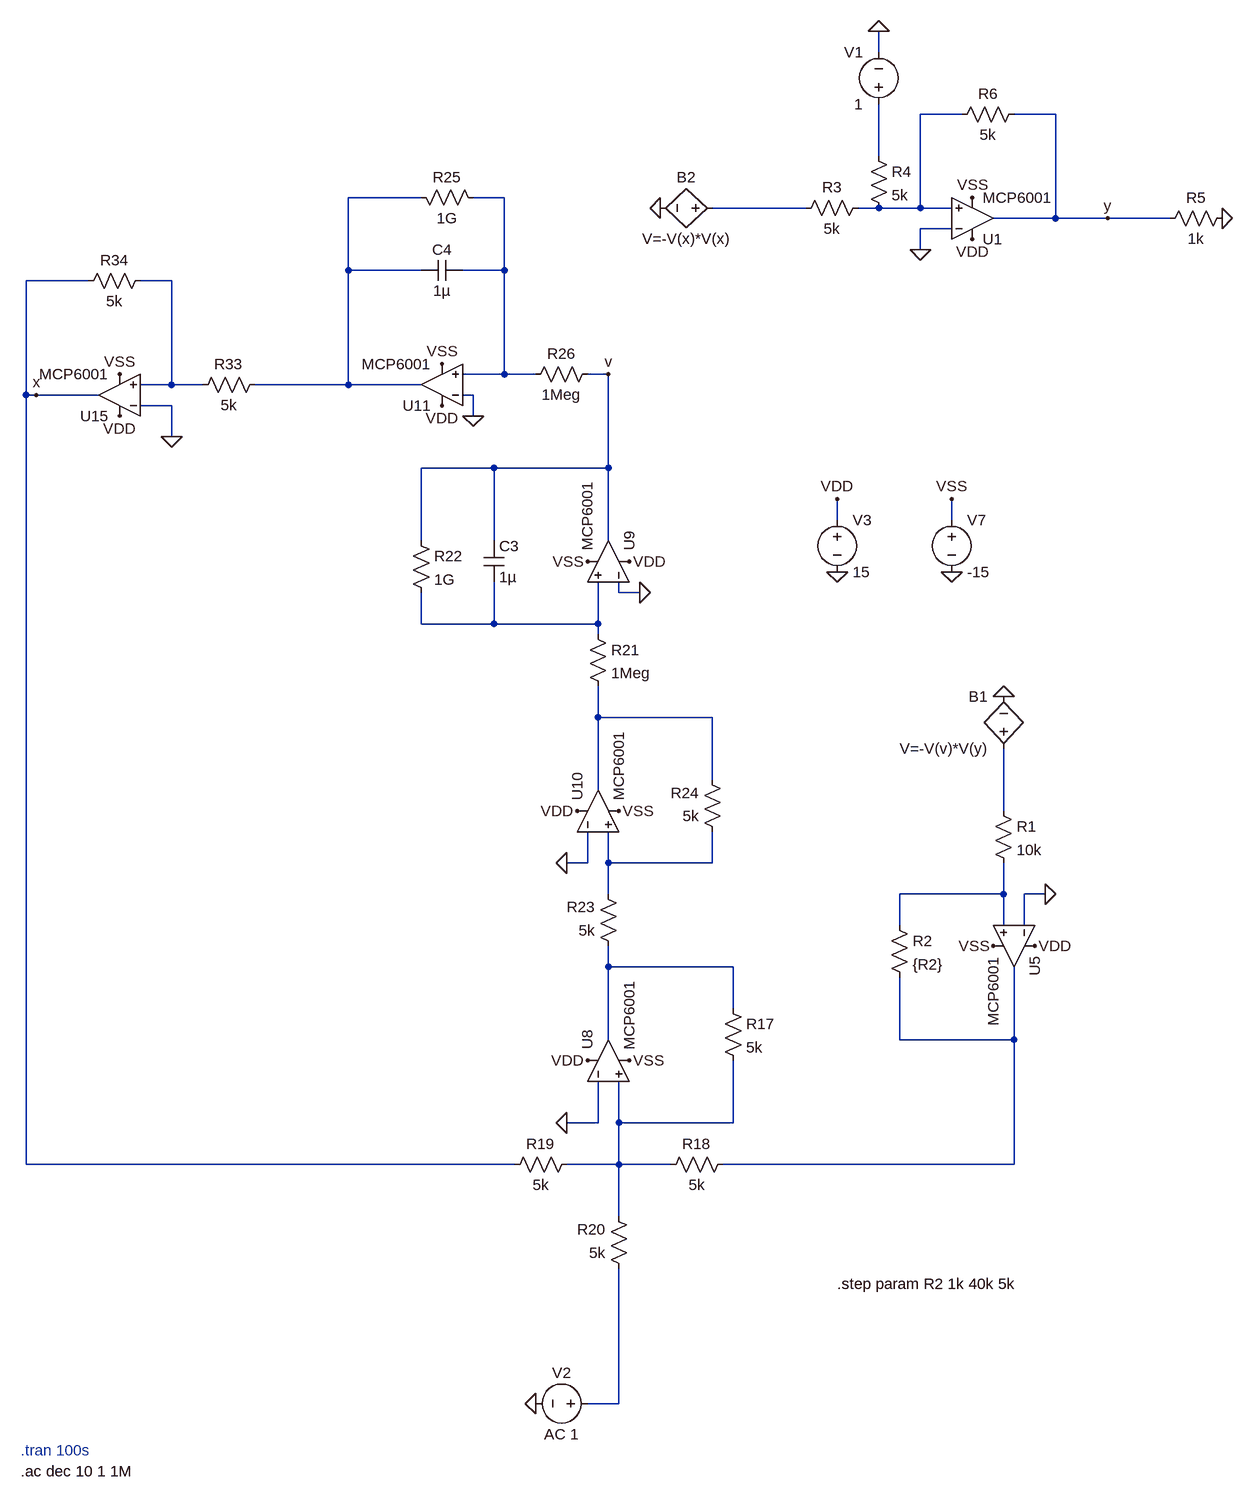
[diagram p0: schematic vanderpol.asc]
vanderpol.asc, the LTspice schematic file:
Version 4
SHEET 1 4244 1992
WIRE 3696 -208 3696 -240
WIRE 3824 -112 3760 -112
WIRE 3968 -112 3904 -112
WIRE 3696 -48 3696 -128
WIRE 2992 16 2880 16
WIRE 3120 16 3072 16
WIRE 3584 32 3440 32
WIRE 3696 32 3664 32
WIRE 3760 32 3760 -112
WIRE 3760 32 3696 32
WIRE 3808 32 3760 32
WIRE 3968 48 3968 -112
WIRE 3968 48 3872 48
WIRE 4048 48 3968 48
WIRE 4144 48 4048 48
WIRE 3808 64 3760 64
WIRE 3760 96 3760 64
WIRE 2880 128 2880 16
WIRE 2992 128 2880 128
WIRE 3120 128 3120 16
WIRE 3120 128 3056 128
WIRE 2480 144 2384 144
WIRE 2608 144 2560 144
WIRE 3120 288 3120 128
WIRE 3120 288 3056 288
WIRE 3168 288 3120 288
WIRE 3280 288 3248 288
WIRE 2608 304 2608 144
WIRE 2608 304 2560 304
WIRE 2656 304 2608 304
WIRE 2880 304 2880 128
WIRE 2880 304 2736 304
WIRE 2992 304 2880 304
WIRE 2384 320 2384 144
WIRE 2400 320 2384 320
WIRE 2496 320 2400 320
WIRE 3072 320 3056 320
WIRE 2608 336 2560 336
WIRE 3072 352 3072 320
WIRE 2608 384 2608 336
WIRE 3104 432 2992 432
WIRE 3280 432 3280 288
WIRE 3280 432 3104 432
WIRE 3632 512 3632 480
WIRE 3808 512 3808 480
WIRE 2992 544 2992 432
WIRE 3104 544 3104 432
WIRE 3280 544 3280 432
WIRE 3296 624 3296 608
WIRE 3328 624 3296 624
WIRE 2992 672 2992 624
WIRE 3104 672 3104 608
WIRE 3104 672 2992 672
WIRE 3264 672 3264 608
WIRE 3264 672 3104 672
WIRE 3264 688 3264 672
WIRE 3264 816 3264 768
WIRE 3440 816 3264 816
WIRE 3440 912 3440 816
WIRE 3264 928 3264 816
WIRE 3888 960 3888 864
WIRE 3248 1040 3248 992
WIRE 3248 1040 3216 1040
WIRE 3280 1040 3280 992
WIRE 3440 1040 3440 992
WIRE 3440 1040 3280 1040
WIRE 3280 1088 3280 1040
WIRE 3888 1088 3888 1040
WIRE 3888 1088 3728 1088
WIRE 3952 1088 3920 1088
WIRE 3728 1136 3728 1088
WIRE 3888 1136 3888 1088
WIRE 3920 1136 3920 1088
WIRE 3280 1200 3280 1168
WIRE 3472 1200 3280 1200
WIRE 3472 1264 3472 1200
WIRE 3280 1312 3280 1200
WIRE 3728 1312 3728 1216
WIRE 3904 1312 3904 1200
WIRE 3904 1312 3728 1312
WIRE 3264 1440 3264 1376
WIRE 3264 1440 3216 1440
WIRE 3296 1440 3296 1376
WIRE 3472 1440 3472 1344
WIRE 3472 1440 3296 1440
WIRE 2384 1504 2384 320
WIRE 3136 1504 2384 1504
WIRE 3296 1504 3296 1440
WIRE 3296 1504 3216 1504
WIRE 3376 1504 3296 1504
WIRE 3904 1504 3904 1312
WIRE 3904 1504 3456 1504
WIRE 3296 1584 3296 1504
WIRE 3296 1872 3296 1664
WIRE 3296 1872 3248 1872
FLAG 3888 784 0
FLAG 3952 1088 0
FLAG 3872 1168 VSS
FLAG 3936 1168 VDD
FLAG 3168 1872 0
FLAG 3216 1440 0
FLAG 3312 1344 VSS
FLAG 3248 1344 VDD
FLAG 3632 592 0
FLAG 3632 480 VDD
FLAG 3808 592 0
FLAG 3808 480 VSS
FLAG 3216 1040 0
FLAG 3296 960 VSS
FLAG 3232 960 VDD
FLAG 3328 624 0
FLAG 3312 576 VDD
FLAG 3248 576 VSS
FLAG 3072 352 0
FLAG 3024 336 VDD
FLAG 3024 272 VSS
FLAG 2528 288 VSS
FLAG 2528 352 VDD
FLAG 2400 320 x
FLAG 2608 384 0
FLAG 3760 96 0
FLAG 3840 16 VSS
FLAG 3840 80 VDD
FLAG 3360 32 0
FLAG 3280 288 v
FLAG 4224 48 0
FLAG 4048 48 y
FLAG 3696 -240 0
SYMBOL bv 3888 880 R180
WINDOW 0 24 96 Left 2
WINDOW 3 24 16 Left 2
SYMATTR InstName B1
SYMATTR Value V=-V(v)*V(y)
SYMBOL res 3872 944 R0
SYMATTR InstName R1
SYMATTR Value 10k
SYMATTR SpiceLine tol=1 pwr=0.1
SYMBOL MCP6001 3904 1168 R90
SYMATTR InstName U5
SYMBOL res 3712 1120 R0
SYMATTR InstName R2
SYMATTR Value {R2}
SYMBOL MCP6001 3280 1344 R270
SYMATTR InstName U8
SYMBOL res 3456 1248 R0
SYMATTR InstName R17
SYMATTR Value 5k
SYMBOL res 3472 1488 R90
WINDOW 0 0 56 VBottom 2
WINDOW 3 32 56 VTop 2
SYMATTR InstName R18
SYMATTR Value 5k
SYMBOL res 3232 1488 R90
WINDOW 0 0 56 VBottom 2
WINDOW 3 32 56 VTop 2
SYMATTR InstName R19
SYMATTR Value 5k
SYMBOL res 3312 1680 R180
WINDOW 0 36 76 Left 2
WINDOW 3 36 40 Left 2
SYMATTR InstName R20
SYMATTR Value 5k
SYMBOL voltage 3632 496 R0
SYMATTR InstName V3
SYMATTR Value 15
SYMBOL voltage 3808 496 R0
SYMATTR InstName V7
SYMATTR Value -15
SYMBOL res 3296 1184 R180
WINDOW 0 36 76 Left 2
WINDOW 3 36 40 Left 2
SYMATTR InstName R23
SYMATTR Value 5k
SYMBOL MCP6001 3264 960 R270
SYMATTR InstName U10
SYMBOL res 3456 1008 R180
WINDOW 0 36 76 Left 2
WINDOW 3 36 40 Left 2
SYMATTR InstName R24
SYMATTR Value 5k
SYMBOL res 3248 672 R0
SYMATTR InstName R21
SYMATTR Value 1Meg
SYMBOL MCP6001 3280 576 M270
SYMATTR InstName U9
SYMBOL cap 3088 544 R0
SYMATTR InstName C3
SYMATTR Value 1µ
SYMBOL res 2976 528 R0
SYMATTR InstName R22
SYMATTR Value 1G
SYMBOL MCP6001 3024 304 R180
SYMATTR InstName U11
SYMBOL cap 2992 112 M90
WINDOW 0 0 32 VBottom 2
WINDOW 3 32 32 VTop 2
SYMATTR InstName C4
SYMATTR Value 1µ
SYMBOL res 2976 0 M90
WINDOW 0 0 56 VBottom 2
WINDOW 3 32 56 VTop 2
SYMATTR InstName R25
SYMATTR Value 1G
SYMBOL res 3264 272 R90
WINDOW 0 0 56 VBottom 2
WINDOW 3 32 56 VTop 2
SYMATTR InstName R26
SYMATTR Value 1Meg
SYMBOL res 2752 288 R90
WINDOW 0 0 56 VBottom 2
WINDOW 3 32 56 VTop 2
SYMATTR InstName R33
SYMATTR Value 5k
SYMBOL MCP6001 2528 320 R180
SYMATTR InstName U15
SYMBOL res 2576 128 R90
WINDOW 0 0 56 VBottom 2
WINDOW 3 32 56 VTop 2
SYMATTR InstName R34
SYMATTR Value 5k
SYMBOL bv 3456 32 R90
WINDOW 0 -32 56 VBottom 2
WINDOW 3 32 56 VTop 2
SYMATTR InstName B2
SYMATTR Value V=-V(x)*V(x)
SYMBOL res 3680 16 R90
WINDOW 0 0 56 VBottom 2
WINDOW 3 32 56 VTop 2
SYMATTR InstName R3
SYMATTR Value 5k
SYMBOL MCP6001 3840 48 M180
SYMATTR InstName U1
SYMBOL res 4240 32 R90
WINDOW 0 0 56 VBottom 2
WINDOW 3 32 56 VTop 2
SYMATTR InstName R5
SYMATTR Value 1k
SYMBOL res 3680 -64 R0
SYMATTR InstName R4
SYMATTR Value 5k
SYMBOL voltage 3696 -112 R180
WINDOW 0 24 96 Left 2
WINDOW 3 24 16 Left 2
WINDOW 123 0 0 Left 0
WINDOW 39 0 0 Left 0
SYMATTR InstName V1
SYMATTR Value 1
SYMBOL res 3920 -128 R90
WINDOW 0 0 56 VBottom 2
WINDOW 3 32 56 VTop 2
SYMATTR InstName R6
SYMATTR Value 5k
SYMBOL voltage 3264 1872 R90
WINDOW 0 -32 56 VBottom 2
WINDOW 3 32 56 VTop 2
WINDOW 123 0 0 Left 0
WINDOW 39 0 0 Left 0
SYMATTR InstName V2
SYMATTR Value AC 1
TEXT 2376 1944 Left 2 ;.tran 100s
TEXT 3632 1688 Left 2 !.step param R2 1k 40k 5k
TEXT 2376 1976 Left 2 !.ac dec 10 1 1M

The netlist it stands for:
* vanderpol.asc
B1 N009 0 V=-V(v)*V(y)
R1 N009 N011 10k tol=1 pwr=0.1
* U5: MCP6001 (symbol MCP6001 not available, pins judged from their places): In+=N011 In-=0 V+=VDD V-=VSS OUT=N013
R2 N011 N013 {R2}
* U8: MCP6001 (symbol MCP6001 not available, pins judged from their places): In+=N014 In-=0 V+=VDD V-=VSS OUT=N012
R17 N012 N014 5k
R18 N013 N014 5k
R19 N014 x 5k
R20 N015 N014 5k
V3 VDD 0 15
V7 VSS 0 -15
R23 N012 N010 5k
* U10: MCP6001 (symbol MCP6001 not available, pins judged from their places): In+=N010 In-=0 V+=VDD V-=VSS OUT=N008
R24 N010 N008 5k
R21 N007 N008 1Meg
* U9: MCP6001 (symbol MCP6001 not available, pins judged from their places): In+=N007 In-=0 V+=VDD V-=VSS OUT=v
C3 v N007 1µ
R22 v N007 1G
* U11: MCP6001 (symbol MCP6001 not available, pins judged from their places): In+=N004 In-=0 V+=VDD V-=VSS OUT=N003
C4 N003 N004 1µ
R25 N003 N004 1G
R26 v N004 1Meg
R33 N003 N006 5k
* U15: MCP6001 (symbol MCP6001 not available, pins judged from their places): In+=N006 In-=0 V+=VDD V-=VSS OUT=x
R34 N006 x 5k
B2 N005 0 V=-V(x)*V(x)
R3 N001 N005 5k
* U1: MCP6001 (symbol MCP6001 not available, pins judged from their places): In+=N001 In-=0 V+=VDD V-=VSS OUT=y
R5 0 y 1k
R4 N002 N001 5k
V1 N002 0 1
R6 y N001 5k
V2 N015 0 AC 1
* .tran 100s
.step param R2 1k 40k 5k
.ac dec 10 1 1M
.backanno
.end